# EAGLE design VDU_TMS_final_rev01 (EAGLE 9.6.2)
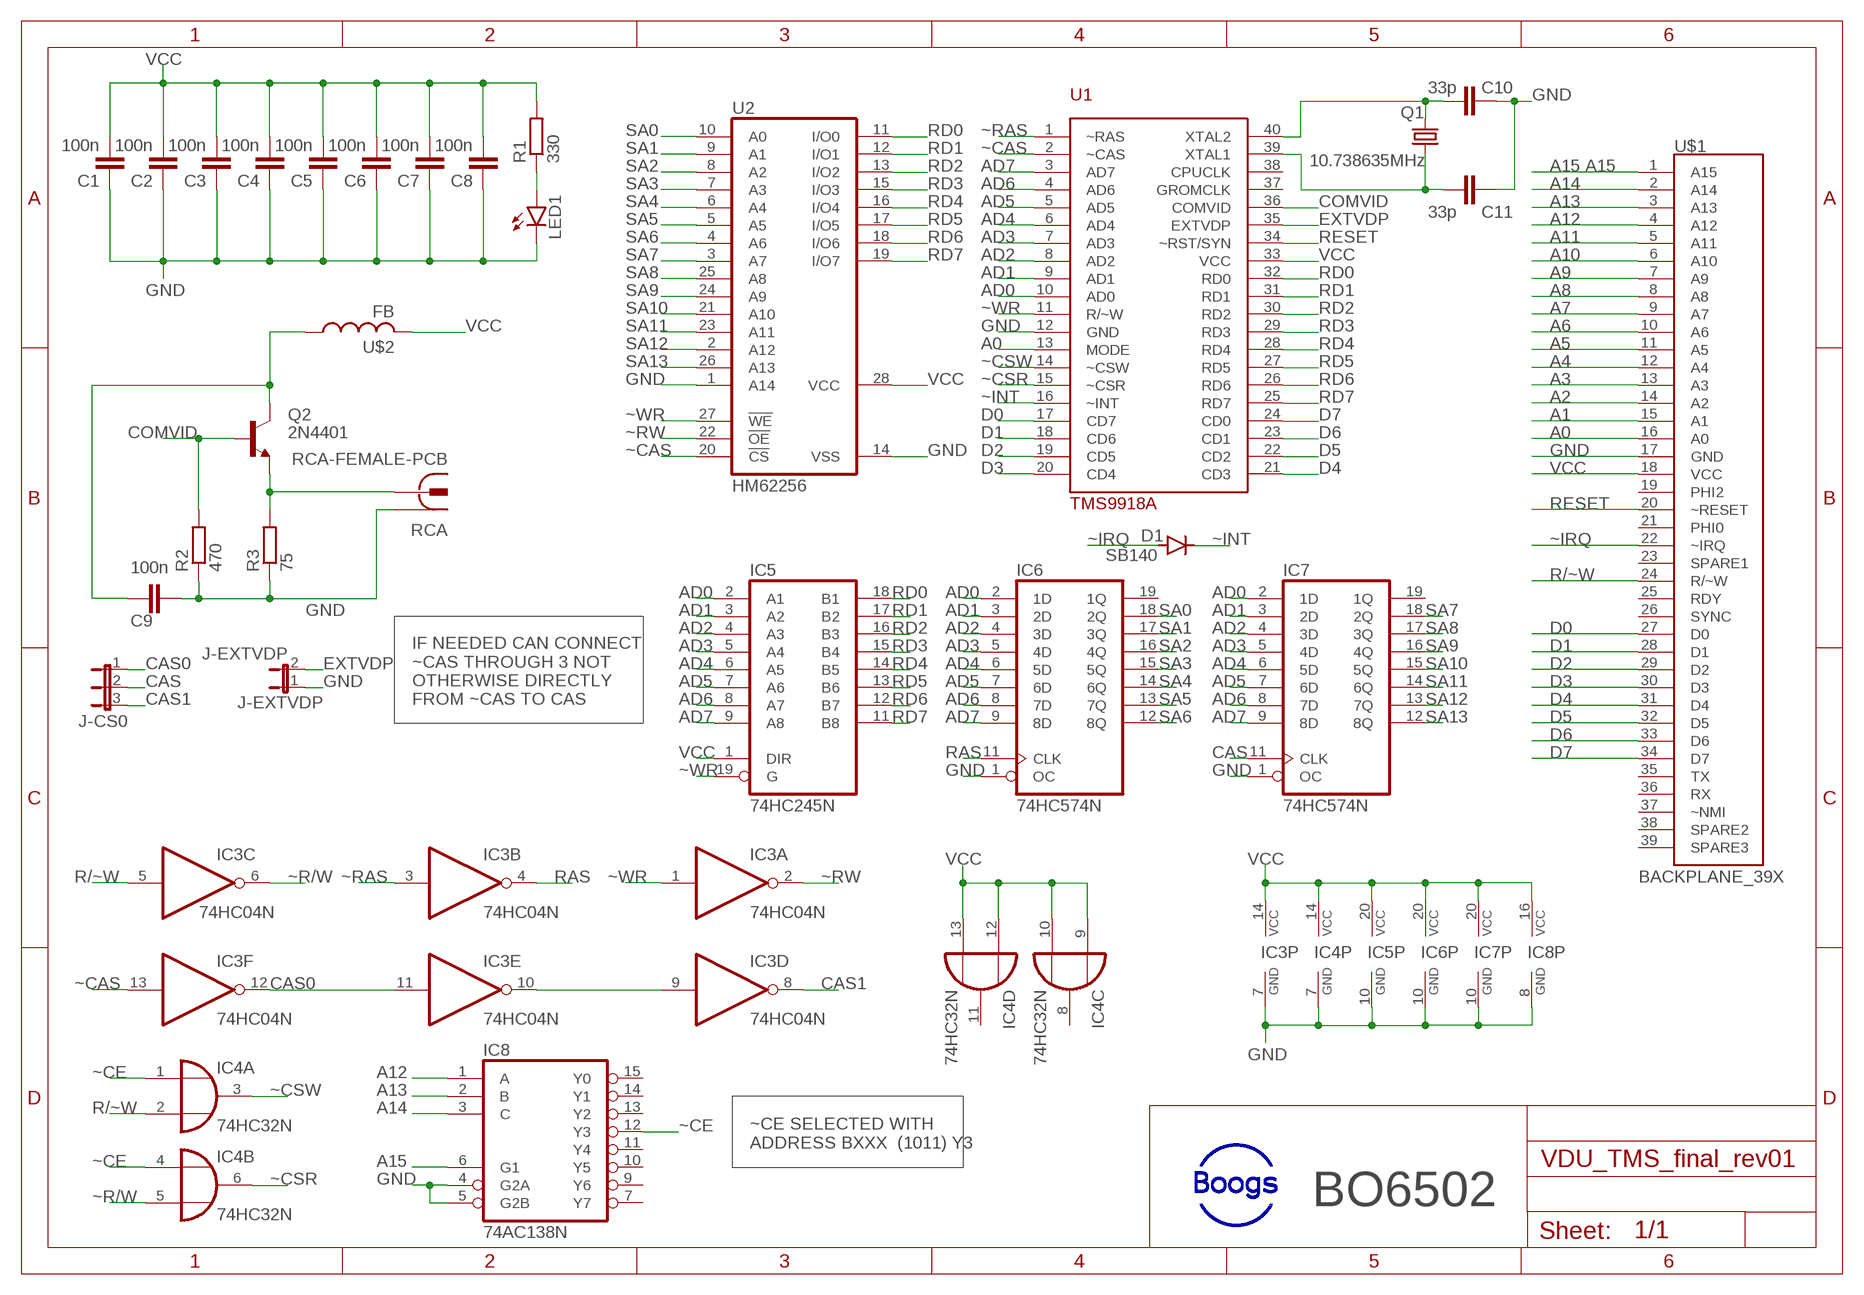
[diagram p0: schematic, sheet 1]

## Parts
C1  100n  C-EU025-025X050  [C025-025X050]
C2  100n  C-EU025-025X050  [C025-025X050]
C3  100n  C-EU025-025X050  [C025-025X050]
C4  100n  C-EU025-025X050  [C025-025X050]
C5  100n  C-EU025-025X050  [C025-025X050]
C6  100n  C-EU025-025X050  [C025-025X050]
C7  100n  C-EU025-025X050  [C025-025X050]
C8  100n  C-EU025-025X050  [C025-025X050]
C9  100n  C-EU025-025X050  [C025-025X050]
C10  33p  C-EU025-025X050  [C025-025X050]
C11  33p  C-EU025-025X050  [C025-025X050]
D1  SB140  1N4004  [DO41-10]
IC3  74HC04N  [DIL14]
IC4  74HC32N  [DIL14]
IC5  74HC245N  [DIL20]
IC6  74HC574N  [DIL20]
IC7  74HC574N  [DIL20]
IC8  74AC138N  [DIL16]
J-CAS  J-CS0  JP2E  [JP2]
J-EXTVDP  J-EXTVDP  JP1E  [JP1]
LED1  RED  LED5MM  [LED5MM]
Q1  10.738635MHz  CRYSTALHC49S  [HC49/S]
Q2  2N4401  -NPN-TO92-EBC  [TO92-EBC]
R1  330  R-EU_0207/10  [0207/10]
R2  470  R-EU_0207/10  [0207/10]
R3  75  R-EU_0207/10  [0207/10]
RCA  RCA-FEMALE-PCB  [RCA-FEMALE-PCB]
U1  TMS9918A  [DIL40]
U2  HM62256  62256P  [DIL28-6]
U$1  BACKPLANE_39X  [BP_39X]
U$2  FB  [FB]

## Nets
A0: U1.13(MODE) U$1.16(A0)
A1: U$1.15(A1)
A2: U$1.14(A2)
A3: U$1.13(A3)
A4: U$1.12(A4)
A5: U$1.11(A5)
A6: U$1.10(A6)
A7: U$1.9(A7)
A8: U$1.8(A8)
A9: U$1.7(A9)
A10: U$1.6(A10)
A11: U$1.5(A11)
A12: IC8.1(A) U$1.4(A12)
A13: IC8.2(B) U$1.3(A13)
A14: IC8.3(C) U$1.2(A14)
A15: IC8.6(G1) U$1.1(A15)
AD0: IC5.2(A1) IC6.2(1D) IC7.2(1D) U1.10(AD0)
AD1: IC5.3(A2) IC6.3(2D) IC7.3(2D) U1.9(AD1)
AD2: IC5.4(A3) IC6.4(3D) IC7.4(3D) U1.8(AD2)
AD3: IC5.5(A4) IC6.5(4D) IC7.5(4D) U1.7(AD3)
AD4: IC5.6(A5) IC6.6(5D) IC7.6(5D) U1.6(AD4)
AD5: IC5.7(A6) IC6.7(6D) IC7.7(6D) U1.5(AD5)
AD6: IC5.8(A7) IC6.8(7D) IC7.8(7D) U1.4(AD6)
AD7: IC5.9(A8) IC6.9(8D) IC7.9(8D) U1.3(AD7)
CAS: IC7.11(CLK) J-CAS.2
CAS0: IC3.11(E:I) IC3.12(F:O) J-CAS.1
CAS1: IC3.8(D:O) J-CAS.3
COMVID: Q2.B R2.2 U1.36(COMVID)
D0: U1.17(CD7) U$1.27(D0)
D1: U1.18(CD6) U$1.28(D1)
D2: U1.19(CD5) U$1.29(D2)
D3: U1.20(CD4) U$1.30(D3)
D4: U1.21(CD3) U$1.31(D4)
D5: U1.22(CD2) U$1.32(D5)
D6: U1.23(CD1) U$1.33(D6)
D7: U1.24(CD0) U$1.34(D7)
EXTVDP: J-EXTVDP.2 U1.35(EXTVDP)
GND: C1.1 C2.1 C3.1 C4.1 C5.1 C6.1 C7.1 C8.1 C9.1 C10.1 C11.1 IC3.7(P:GND) IC4.7(P:GND) IC5.10(GND) IC6.1(OC) IC6.10(GND) IC7.1(OC) IC7.10(GND) IC8.4(G2A) IC8.5(G2B) IC8.8(GND) J-EXTVDP.1 LED1.K(C) R2.1 R3.1 RCA.1 U1.12(GND) U2.1(A14) U2.14(VSS) U$1.17(GND)
N$2: Q2.E R3.2 RCA.2@1 RCA.2@2
N$3: C9.2 Q2.C U$2.P$1
N$5: C10.2 Q1.2 U1.40(XTAL2)
N$6: LED1.A R1.1
N$8: C11.2 Q1.1 U1.39(XTAL1)
N$12: IC3.9(D:I) IC3.10(E:O)
R/~W: IC3.5(C:I) IC4.2(A:I1) U$1.24(R/~W)
RAS: IC3.4(B:O) IC6.11(CLK)
RD0: IC5.18(B1) U1.32(RD0) U2.11(I/O0)
RD1: IC5.17(B2) U1.31(RD1) U2.12(I/O1)
RD2: IC5.16(B3) U1.30(RD2) U2.13(I/O2)
RD3: IC5.15(B4) U1.29(RD3) U2.15(I/O3)
RD4: IC5.14(B5) U1.28(RD4) U2.16(I/O4)
RD5: IC5.13(B6) U1.27(RD5) U2.17(I/O5)
RD6: IC5.12(B7) U1.26(RD6) U2.18(I/O6)
RD7: IC5.11(B8) U1.25(RD7) U2.19(I/O7)
RESET: U1.34(~RST/SYN) U$1.20(~RESET)
SA0: IC6.18(2Q) U2.10(A0)
SA1: IC6.17(3Q) U2.9(A1)
SA2: IC6.16(4Q) U2.8(A2)
SA3: IC6.15(5Q) U2.7(A3)
SA4: IC6.14(6Q) U2.6(A4)
SA5: IC6.13(7Q) U2.5(A5)
SA6: IC6.12(8Q) U2.4(A6)
SA7: IC7.18(2Q) U2.3(A7)
SA8: IC7.17(3Q) U2.25(A8)
SA9: IC7.16(4Q) U2.24(A9)
SA10: IC7.15(5Q) U2.21(A10)
SA11: IC7.14(6Q) U2.23(A11)
SA12: IC7.13(7Q) U2.2(A12)
SA13: IC7.12(8Q) U2.26(A13)
VCC: C1.2 C2.2 C3.2 C4.2 C5.2 C6.2 C7.2 C8.2 IC3.14(P:VCC) IC4.9(C:I0) IC4.10(C:I1) IC4.12(D:I0) IC4.13(D:I1) IC4.14(P:VCC) IC5.1(DIR) IC5.20(VCC) IC6.20(VCC) IC7.20(VCC) IC8.16(VCC) R1.2 U1.33(VCC) U2.28(VCC) U$1.18(VCC) U$2.P$2
~CAS: IC3.13(F:I) U1.2(~CAS) U2.20(!CS)
~CE: IC4.1(A:I0) IC4.4(B:I0) IC8.12(Y3)
~CSR: IC4.6(B:O) U1.15(~CSR)
~CSW: IC4.3(A:O) U1.14(~CSW)
~INT: D1.C U1.16(~INT)
~IRQ: D1.A U$1.22(~IRQ)
~R/W: IC3.6(C:O) IC4.5(B:I1)
~RAS: IC3.3(B:I) U1.1(~RAS)
~RW: IC3.2(A:O) U2.22(!OE)
~WR: IC3.1(A:I) IC5.19(G) U1.11(R/~W) U2.27(!WE)
Unconnected: IC4.8(C:O) IC4.11(D:O) IC6.19(1Q) IC7.19(1Q) IC8.7(Y7) IC8.9(Y6) IC8.10(Y5) IC8.11(Y4) IC8.13(Y2) IC8.14(Y1) IC8.15(Y0) U1.37(GROMCLK) U1.38(CPUCLK) U$1.19(PHI2) U$1.21(PHI0) U$1.23(SPARE1) U$1.25(RDY) U$1.26(SYNC) U$1.35(TX) U$1.36(RX) U$1.37(~NMI) U$1.38(SPARE2) U$1.39(SPARE3)

## Notes on the sheet
- IF NEEDED CAN CONNECT 
  ~CAS THROUGH 3 NOT 
  OTHERWISE DIRECTLY 
  FROM ~CAS TO CAS
- ~CE SELECTED WITH
  ADDRESS BXXX  (1011) Y3
- BO6502

## Library data of the parts
C1-C11 = rcl:C-EU: CAPACITOR, European symbol; SPICEPREFIX: C
D1 = diode:1N4004: DIODE general purpose rectifier, 1 A
IC3 = 74xx-eu:74*04: Hex INVERTER
IC4 = 74xx-eu:74*32: Quad 2-input OR gate
IC5 = 74xx-eu:74*245: Octal BUS TRANSCEIVER, 3-state
IC6 IC7 = 74xx-eu:74*574: 8-bit D type FLIP FLOP bus driver
IC8 = 74xx-eu:74*138: 3-line to 8-line DECODER/DEMULTIPLEXER
J-CAS = jumper:JP2E: JUMPER
J-EXTVDP = jumper:JP1E: JUMPER
LED1 = led:LED: LED OSRAM: - CHIPLED LG R971, LG N971, LY N971, LG Q971, LY Q971, LO R971, LY R971 LH N974, LH R974 LS Q976, LO Q976, LY Q976 LO Q996 - Hyper CHIPLED LW Q18S LB Q993, LB Q99A, LB R99A - SideLED LS A670, LO A670, LY A670, LG A670, LP A670 LB A673, LV A673, LT A673, LW A673 LH A674 LY A675 LS A676, LA A676, LO A676, LY A676, LW A676 LS A679, LY A679, LG A679 - Hyper Micro SIDELED® LS Y876, LA Y876, LO Y876, LY Y876 LT Y87S - SmartLED LW L88C, LW L88S LB L89C, LB L89S, LG L890 LS L89K, LO L89K, LY L89K LS L896, LA L896, LO L896, LY L896 - TOPLED LS T670, LO T670, LY T670, LG T670, LP T670 LSG T670, LSP T670, LSY T670, LOP T670, LYG T670 LG T671, LOG T671, LSG T671 LB T673, LV T673, LT T673, LW T673 LH T674 LS T676, LA T676, LO T676, LY T676, LB T676, LH T676, LSB T676, LW T676 LB T67C, LV T67C, LT T67C, LS T67K, LO T67K, LY T67K, LW E67C LS E67B, LA E67B, LO E67B, LY E67B, LB E67C, LV E67C, LT E67C LW T67C LS T679, LY T679, LG T679 LS T770, LO T770, LY T770, LG T770, LP T770 LB T773, LV T773, LT T773, LW T773 LH T774 LS E675, LA E675, LY E675, LS T675 LS T776, LA T776, LO T776, LY T776, LB T776 LHGB T686 LT T68C, LB T68C - Hyper Mini TOPLED® LB M676 - Mini TOPLED Santana® LG M470 LS M47K, LO M47K, LY M47K Source: http://www.osram.convergy.de LUXEON: - LUMILED® LXK2-PW12-R00, LXK2-PW12-S00, LXK2-PW14-U00, LXK2-PW14-V00 LXK2-PM12-R00, LXK2-PM12-S00, LXK2-PM14-U00 LXK2-PE12-Q00, LXK2-PE12-R00, LXK2-PE12-S00, LXK2-PE14-T00, LXK2-PE14-U00 LXK2-PB12-K00, LXK2-PB12-L00, LXK2-PB12-M00, LXK2-PB14-N00, LXK2-PB14-P00, LXK2-PB14-Q00 LXK2-PR12-L00, LXK2-PR12-M00, LXK2-PR14-Q00, LXK2-PR14-R00 LXK2-PD12-Q00, LXK2-PD12-R00, LXK2-PD12-S00 LXK2-PH12-R00, LXK2-PH12-S00 LXK2-PL12-P00, LXK2-PL12-Q00, LXK2-PL12-R00 Source: www.luxeon.com KINGBRIGHT: KA-3528ASYC Source: www.kingbright.com
Q1 = crystal:CRYSTAL: CRYSTAL; OC_FARNELL: 1667008; OC_NEWARK: unknown
Q2 = transistor:*-NPN-: NPN Transistror BF959 corrected 2008.03.06
R1-R3 = rcl:R-EU_: RESISTOR, European symbol; SPICEPREFIX: R
RCA = 65xx_family:RCA-FEMALE-PCB
U1 = 65xx_family:TMS9918A
U2 = memory-hitachi:62256P: MEMORY; OC_FARNELL: unknown; OC_NEWARK: unknown
U$1 = 65xx_family:BACKPLANE_39X; A15: A15
U$2 = adafruit:FB: Ferrite bead Digikey #P9821BK-ND

## Board
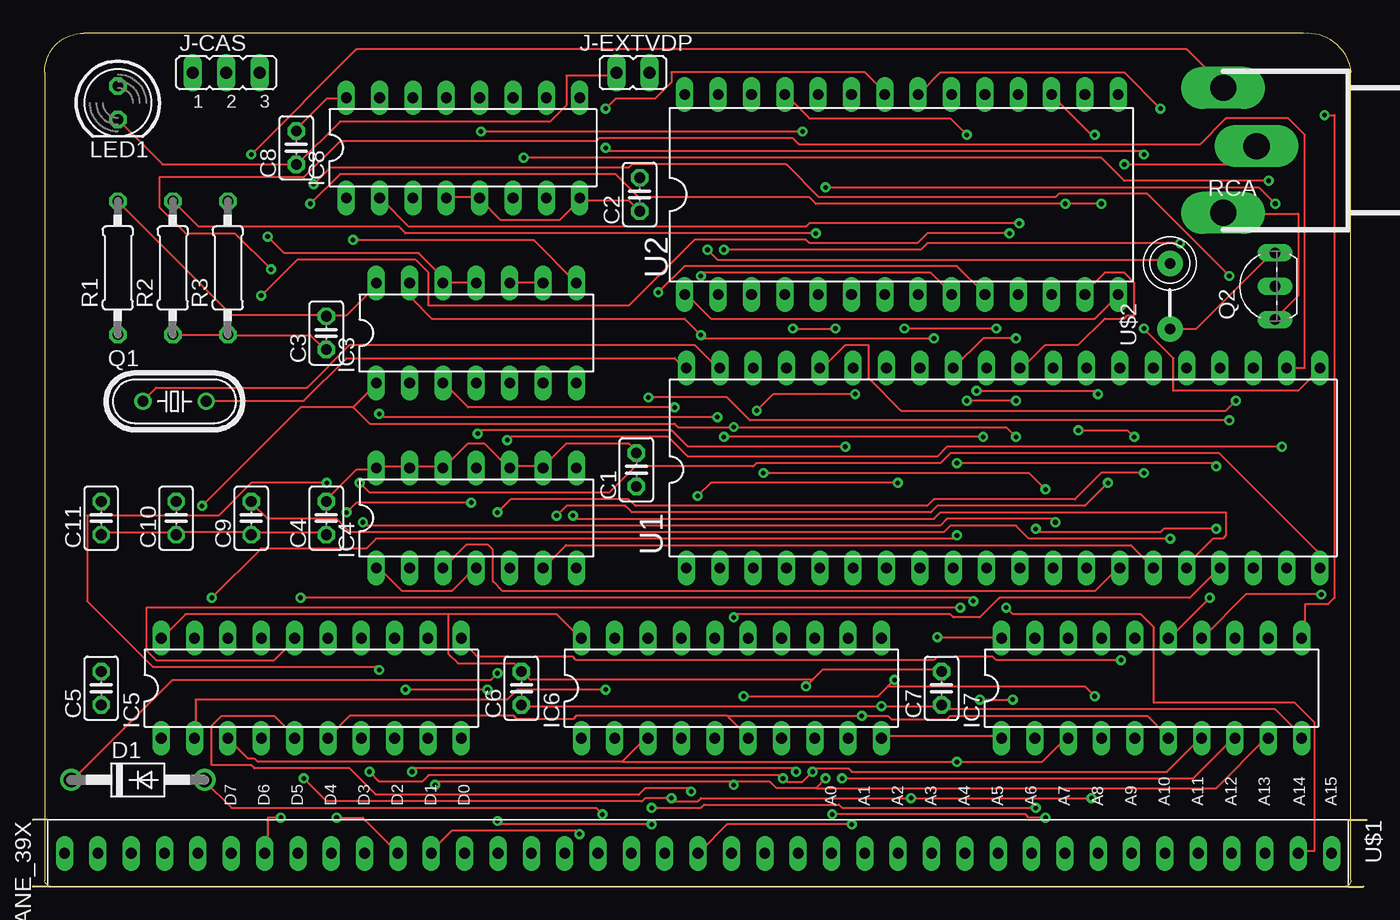
[diagram p1: board, top side]
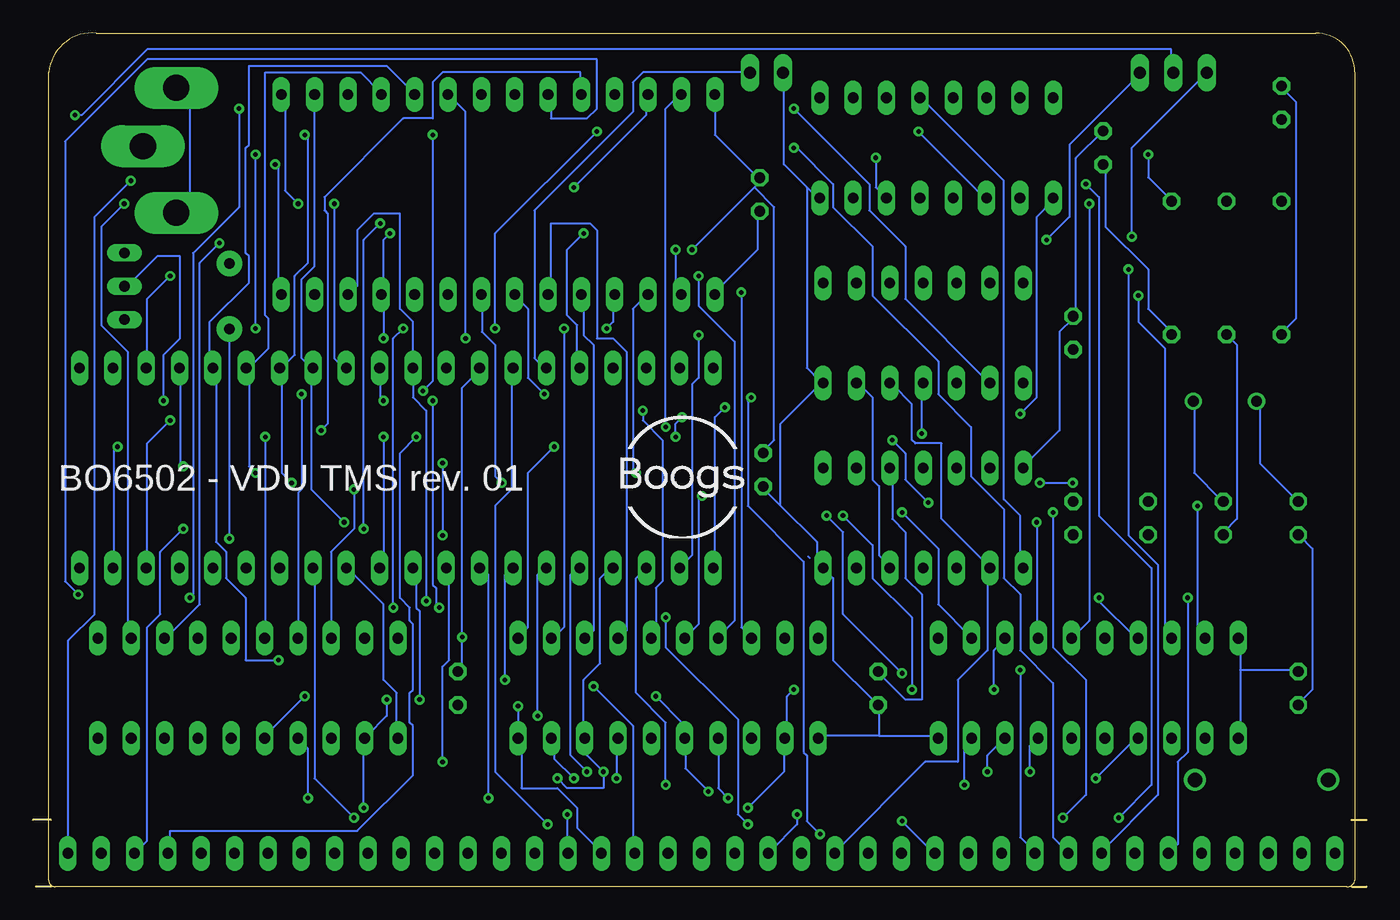
[diagram p2: board, bottom side, seen from below]

Size 101.6 x 65.02 mm. Coordinates in mm from the lower left corner, seen from the top.
Outline: 1.14,5.08 0,5.08
Outline: 1.14,0 0,0
Outline: 100.2,5.08 101.6,5.08
Outline: 100.2,0 101.35,0
Outline: 1.52,0 99.89,0 arc90 100.39,0.5 100.39,62 arc90 96.75,65 3.89,65 arc90 0.89,62 0.89,0.5 arc90 1.52,0
Copper layers (1*16): Top 0.035mm / dielectric 1.5mm / Bottom 0.035mm
Design rules "default *": minimum track width 6mil, minimum drill 0.35mm, track to track 10mil, track to pad 10mil, pad to pad 10mil, via to via 10mil, smd to smd 6mil, copper to edge 40mil, drill to drill 6mil, minimum pad ring 10mil, minimum via ring 8mil, stop-mask expansion 4mil, vias tented up to drill 15mil, thermal gap 10mil

### Footprints (pad centres in the part's own frame; a part is rotated, then mirrored left to right if it is on the bottom)
C025-025X050 = drill 0.813 octagon: 1 -1.27,0; 2 1.27,0
DO41-10 = drill 1.118: A 5.08,0; C -5.08,0
DIL14 = drill 0.813 long: 1 -7.62,-3.81; 2 -5.08,-3.81; 3 -2.54,-3.81; 4 0,-3.81; 5 2.54,-3.81; 6 5.08,-3.81; 7 7.62,-3.81; 8 7.62,3.81; 9 5.08,3.81; 10 2.54,3.81; 11 0,3.81; 12 -2.54,3.81; 13 -5.08,3.81; 14 -7.62,3.81
DIL20 = drill 0.813 long: 1 -11.43,-3.81; 2 -8.89,-3.81; 3 -6.35,-3.81; 4 -3.81,-3.81; 5 -1.27,-3.81; 6 1.27,-3.81; 7 3.81,-3.81; 8 6.35,-3.81; 9 8.89,-3.81; 10 11.43,-3.81; 11 11.43,3.81; 12 8.89,3.81; 13 6.35,3.81; 14 3.81,3.81; 15 1.27,3.81; 16 -1.27,3.81; 17 -3.81,3.81; 18 -6.35,3.81; 19 -8.89,3.81; 20 -11.43,3.81
DIL16 = drill 0.813 long: 1 -8.89,-3.81; 2 -6.35,-3.81; 3 -3.81,-3.81; 4 -1.27,-3.81; 5 1.27,-3.81; 6 3.81,-3.81; 7 6.35,-3.81; 8 8.89,-3.81; 9 8.89,3.81; 10 6.35,3.81; 11 3.81,3.81; 12 1.27,3.81; 13 -1.27,3.81; 14 -3.81,3.81; 15 -6.35,3.81; 16 -8.89,3.81
JP2 = drill 0.914 long: 1 -2.54,0; 2 0,0; 3 2.54,0
JP1 = drill 0.914 long: 1 0,-1.27; 2 0,1.27
LED5MM = drill 0.813 octagon: A -1.27,0; K 1.27,0
HC49/S = drill 0.813: 1 -2.413,0; 2 2.413,0
TO92-EBC = drill 0.813 long: B 0,-1.27; C 2.54,-1.27; E -2.54,-1.27
0207/10 = drill 0.813 octagon: 1 -5.08,0; 2 5.08,0
RCA-FEMALE-PCB = drill 2 pad 3.2 long: 1 2.54,0; 2@1 5.08,5.08; 2@2 5.08,-4.445
DIL40 = drill 0.813 long: 1 -24.13,-7.62; 2 -21.59,-7.62; 3 -19.05,-7.62; 4 -16.51,-7.62; 5 -13.97,-7.62; 6 -11.43,-7.62; 7 -8.89,-7.62; 8 -6.35,-7.62; 9 -3.81,-7.62; 10 -1.27,-7.62; 11 1.27,-7.62; 12 3.81,-7.62; 13 6.35,-7.62; 14 8.89,-7.62; 15 11.43,-7.62; 16 13.97,-7.62; 17 16.51,-7.62; 18 19.05,-7.62; 19 21.59,-7.62; 20 24.13,-7.62; 21 24.13,7.62; 22 21.59,7.62; 23 19.05,7.62; 24 16.51,7.62; 25 13.97,7.62; 26 11.43,7.62; 27 8.89,7.62; 28 6.35,7.62; 29 3.81,7.62; 30 1.27,7.62; 31 -1.27,7.62; 32 -3.81,7.62; 33 -6.35,7.62; 34 -8.89,7.62; 35 -11.43,7.62; 36 -13.97,7.62; 37 -16.51,7.62; 38 -19.05,7.62; 39 -21.59,7.62; 40 -24.13,7.62
DIL28-6 = drill 0.813 long: 1 -16.51,-7.62; 2 -13.97,-7.62; 3 -11.43,-7.62; 4 -8.89,-7.62; 5 -6.35,-7.62; 6 -3.81,-7.62; 7 -1.27,-7.62; 8 1.27,-7.62; 9 3.81,-7.62; 10 6.35,-7.62; 11 8.89,-7.62; 12 11.43,-7.62; 13 13.97,-7.62; 14 16.51,-7.62; 15 16.51,7.62; 16 13.97,7.62; 17 11.43,7.62; 18 8.89,7.62; 19 6.35,7.62; 20 3.81,7.62; 21 1.27,7.62; 22 -1.27,7.62; 23 -3.81,7.62; 24 -6.35,7.62; 25 -8.89,7.62; 26 -11.43,7.62; 27 -13.97,7.62; 28 -16.51,7.62
BP_39X = drill 0.813 long: 1 1.27,59.69; 2 1.27,57.15; 3 1.27,54.61; 4 1.27,52.07; 5 1.27,49.53; 6 1.27,46.99; 7 1.27,44.45; 8 1.27,41.91; 9 1.27,39.37; 10 1.27,36.83; 11 1.27,34.29; 12 1.27,31.75; 13 1.27,29.21; 14 1.27,26.67; 15 1.27,24.13; 16 1.27,21.59; 17 1.27,19.05; 18 1.27,16.51; 19 1.27,13.97; 20 1.27,11.43; 21 1.27,8.89; 22 1.27,6.35; 23 1.27,3.81; 24 1.27,1.27; 25 1.27,-1.27; 26 1.27,-3.81; 27 1.27,-6.35; 28 1.27,-8.89; 29 1.27,-11.43; 30 1.27,-13.97; 31 1.27,-16.51; 32 1.27,-19.05; 33 1.27,-21.59; 34 1.27,-24.13; 35 1.27,-26.67; 36 1.27,-29.21; 37 1.27,-31.75; 38 1.27,-34.29; 39 1.27,-36.83
FB = drill 0.8 pad 1.93: P$1 -2.5,0; P$2 2.5,0

### Placement (x,y rotation side)
C1  45.97,31.75 90 top
C2  46.23,52.71 90 top
C3  22.35,42.17 90 top
C4  22.35,28.07 90 top
C5  5.21,15.12 90 top
C6  37.21,15.12 90 top
C7  69.21,15.12 90 top
C8  20.07,56.26 90 top
C9  16.64,28.07 90 top
C10  10.92,28.07 90 top
C11  5.21,28.07 90 top
D1  8,8.13 0 top
IC3  33.78,42.17 0 top
IC4  33.78,28.07 0 top
IC5  21.21,15.12 0 top
IC6  53.21,15.12 0 top
IC7  85.22,15.12 0 top
IC8  32.77,56.26 0 top
J-CAS  14.73,61.98 0 top
J-EXTVDP  45.72,61.98 270 top
LED1  6.48,59.69 270 top
Q1  10.79,36.96 0 top
Q2  93.34,45.72 90 top
R1  6.48,47.12 90 top
R2  10.67,47.12 90 top
R3  14.86,47.12 90 top
RCA  95.76,56.39 180 top
U1  73.91,31.88 0 top
U2  66.17,52.71 0 top
U$1  39.24,3.81 270 top
U$2  86.61,44.96 90 top

### Tracks (layer width: path | path; a pad name or v marks a point on that pad's centre or on a via)
A0  (via drill 0.35)
  Top 0.152: v60.89,5.5 75.64,5.5 75.89,5.25 v77.14,5.25
  Bottom 0.152: v60.89,5.5 60.89,2.75 U$1.16 | v77.14,5.25 80.14,8.25 80.14,24.25 U1.13
A12  (via drill 0.35)
  Top 0.152: v26.39,36 26.64,35.75 v52.14,35.75 | v72.39,34.25 v52.64,34.25
  Bottom 0.152: v26.39,36 25.14,37.25 25.14,51 23.89,52.25 IC8.1 | v52.14,35.75 52.64,35.25 v52.64,34.25 | v72.39,34.25 73.64,33 73.64,22 72.89,21.25 72.89,20.25 72.64,20 72.64,15 72.89,14.75 72.89,12.5 72.64,12.25 72.64,8.5 76.89,4.25 91.14,4.25 91.14,2.75 U$1.4
A13  (via drill 0.35)
  Top 0.152: v75.14,50.5 59.14,50.5 58.89,50.25 28.64,50.25 26.64,52.25 IC8.2 | v76.39,27.25 76.64,27 85.89,27 86.14,27.25 v90.14,27.25
  Bottom 0.152: v75.14,50.5 76.39,49.25 v76.39,27.25 | v90.14,27.25 91.89,25.5 91.89,20.75 92.89,19.75 92.89,3.5 93.64,2.75 U$1.3
A14  (via drill 0.35)
  Top 0.152: v58.64,57.5 v34.14,57.5 | v73.39,42.5 v66.39,42.5 | v74.14,21.25 74.64,20.75 84.39,20.75 85.39,19.75 85.39,14 96.14,14 97.64,12.5 97.64,2.75 96.64,2.75 U$1.2
  Bottom 0.152: v34.14,57.5 29.14,52.5 IC8.3 | v58.64,57.5 66.39,49.75 v66.39,42.5 | v73.39,42.5 74.14,41.75 v74.14,21.25
A15  (via drill 0.35)
  Top 0.152: v37.39,55.5 81.39,55.5 83.14,53.75 v94.14,53.75
  Bottom 0.152: v37.39,55.5 37.39,53.25 36.64,52.5 IC8.6 | v94.14,53.75 96.89,51 96.89,20.75 98.89,18.75 98.89,2.75 U$1.1
AD0  (via drill 0.35)
  Top 0.152: v72.14,14.25 v74.64,14.25 | v43.64,15 36.89,15 36.14,14.25 12.39,14.25 12.39,11.5 IC5.2 | v76.39,6 61.64,6 61.39,6.25 51.14,6.25 50.89,6 v47.14,6
  Bottom 0.152: v74.64,14.25 74.64,13 76.14,11.5 IC7.2 76.39,11.25 v76.39,6 | v72.14,14.25 72.14,21 72.39,21.25 72.39,24 U1.10 | v43.64,15 44.14,14.5 44.14,11.5 IC6.2 44.39,11.25 44.39,8.75 v47.14,6
AD1  (via drill 0.35)
  Top 0.152: 44.89,9.5 17.14,9.5 16.89,9.75 16.39,9.75 14.89,11.25 IC5.3 | 44.89,9.5 46.64,11.25 IC6.3 | 44.89,9.5 v70.39,9.5 76.89,9.5 78.64,11.25 IC7.3
  Bottom 0.152: v70.39,9.5 70.39,16.75 69.89,17.25 69.89,24.25 U1.9
AD2  (via drill 0.35)
  Top 0.152: v20.64,8.25 22.39,6.5 46.39,6.5 46.64,6.75 v48.64,6.75 48.89,6.5 50.64,6.5 50.89,6.75 v66.89,6.75 v80.64,6.75
  Bottom 0.152: v20.64,8.25 17.64,11.25 IC5.4 | v48.64,6.75 49.39,7.5 49.39,11.25 IC6.4 | v66.89,6.75 66.89,23.75 67.39,24.25 U1.8 | v80.64,6.75 80.64,10.5 81.39,11.25 IC7.4
AD3  (via drill 0.35)
  Top 0.152: v50.14,7.25 49.89,7.5 46.64,7.5 46.14,7 26.14,7 24.14,9 16.89,9 16.64,9.25 13.64,9.25 13.64,12.25 14.39,13 18.39,13 19.89,11.5 IC5.5 | 65.14,15.25 64.39,14.5 v54.14,14.5 | 65.14,15.25 v65.64,15.75 | v80.89,14.5 80.14,15.25 65.14,15.25
  Bottom 0.152: v50.14,7.25 51.89,9 51.89,11.25 IC6.5 52.14,11.5 52.14,12.5 v54.14,14.5 | v65.64,15.75 65.64,23.75 65.14,24.25 U1.7 | v80.89,14.5 83.89,11.5 IC7.5
AD4  (via drill 0.35)
  Top 0.152: 52.89,13 41.39,13 41.14,12.75 36.89,12.75 36.64,13 24.14,13 22.64,11.5 IC5.6 | 52.89,13 54.39,11.5 IC6.6 | 52.89,13 v63.14,13 65.14,13 65.39,12.75 69.64,12.75 69.89,13 84.89,13 86.39,11.5 IC7.6
  Bottom 0.152: v63.14,13 63.14,23.75 62.64,24.25 U1.6
AD5  (via drill 0.35)
  Top 0.152: v25.64,8.75 26.39,8 29.64,8 30.14,8.5 56.89,8.5 v57.14,8.25 57.39,8 58.64,8 v59.39,8.75 59.64,9 62.14,9 62.39,8.75 86.39,8.75 88.89,11.25 IC7.7
  Bottom 0.152: v25.64,8.75 25.64,10.75 25.14,11.25 IC5.7 | v57.14,8.25 57.14,11.25 IC6.7 | v59.39,8.75 60.64,10 60.64,23.75 60.14,24.25 U1.5
AD6  (via drill 0.35)
  Top 0.152: v28.89,8.75 29.14,9 57.89,9 v58.14,8.75 | v61.64,8.25 88.39,8.25 91.39,11.25 IC7.8
  Bottom 0.152: v28.89,8.75 28.89,10 27.64,11.25 IC5.8 | U1.4 57.64,24.25 58.39,23.5 58.39,17 59.64,15.75 59.64,11.5 IC6.8 59.39,11.25 59.39,10 v58.14,8.75 58.14,7.5 60.89,7.5 v61.64,8.25
AD7  (via drill 0.35)
  Top 0.152: v30.64,7.75 30.89,8 53.39,8 | 53.39,8 56.14,8 56.64,7.5 59.64,7.5 | v60.39,8.25 59.64,7.5 | 53.39,8 v53.39,7.75 | 59.64,7.5 90.14,7.5 93.89,11.25 IC7.9
  Bottom 0.152: v30.64,7.75 30.64,10.75 30.14,11.25 IC5.9 | v60.39,8.25 61.89,9.75 61.89,11.25 IC6.9 | v53.39,7.75 53.39,12.5 55.64,14.75 55.64,23.5 54.89,24.25 U1.3
CAS  (via drill 0.35)
  Top 0.152: v98.39,58.75 99.14,58.75 99.14,22 98.64,21.5 96.89,21.5 96.89,19 IC7.11
  Bottom 0.152: v98.39,58.75 97.89,58.75 92.89,63.75 14.89,63.75 14.89,62 J-CAS.2
CAS0  (via drill 0.35)
  Top 0.152: 31.64,46 33.64,46 IC3.11 | 31.64,46 31.39,46 IC3.12 31.64,46 | v17.89,49.5 19.14,48.25 29.39,48.25 31.64,46
  Bottom 0.152: v17.89,49.5 17.89,56.25 12.39,61.75 J-CAS.1
CAS1  (via drill 0.35)
  Top 0.152: v24.39,49.25 38.14,49.25 41.39,46 IC3.8
  Bottom 0.152: v24.39,49.25 22.64,51 22.64,56.5 17.39,61.75 J-CAS.3
COMVID  (via drill 0.35)
  Top 0.152: v59.64,49.75 28.39,49.75 27.89,50.25 12.64,50.25 10.89,52 R2.2 | v91.64,37 90.89,36.25 66.14,36.25 63.64,38.75 63.64,41.25 61.89,41.25 60.14,39.5 U1.36
  Bottom 0.152: v59.64,49.75 60.89,48.5 60.89,43.5 60.14,42.75 60.14,39.5 U1.36 | v91.64,37 91.64,40.5 90.39,41.75 90.39,48 92.14,48 94.39,45.75 Q2.B
D0  (via drill 0.35)
  Top 0.152: v35.39,5 35.64,4.75 v47.14,4.75 | v53.39,20.5 53.64,20.75 69.89,20.75 70.14,20.5 72.14,20.5 73.64,22 88.14,22 90.39,24.25 U1.17
  Bottom 0.152: v35.39,5 33.14,2.75 U$1.27 | v47.14,4.75 47.89,5.5 47.89,12.75 53.39,18.25 v53.39,20.5
D1  (via drill 0.35)
  Top 0.152: v41.64,4 41.39,4.25 31.89,4.25 30.39,2.75 U$1.28 | v46.89,37.25 52.89,37.25 54.64,35.5 v91.14,35.5
  Bottom 0.152: v41.64,4 42.64,5 42.64,10 42.89,10.25 42.89,24.75 47.14,29 47.14,37 v46.89,37.25 | v91.14,35.5 92.89,33.75 92.89,24.5 U1.18
D2  (via drill 0.35)
  Top 0.152: v23.14,5.25 25.14,5.25 27.64,2.75 U$1.29 | v23.89,28.5 24.64,29.25 v33.39,29.25 | v36.14,34 36.39,34.25 48.39,34.25 49.89,32.75 68.89,32.75 69.64,33.5 v95.14,33.5
  Bottom 0.152: v23.14,5.25 21.39,7 21.39,15.75 23.89,18.25 v23.89,28.5 | v33.39,29.25 35.14,31 35.14,33 v36.14,34 | v95.14,33.5 95.39,33.25 95.39,24.5 U1.19
D3  (via drill 0.35)
  Top 0.152: v26.39,16.5 26.14,16.75 9.14,16.75 4.14,21.75 4.14,28.25 14.14,28.25 16.64,30.75 v22.39,30.75 | v24.89,30.75 25.64,30 43.89,30 45.89,32 54.89,32 55.14,32.25 69.14,32.25 69.89,33 90.39,33 97.89,25.5 97.89,24.5 U1.20
  Bottom 0.152: v26.39,16.5 26.39,3.75 25.39,2.75 U$1.30 | v24.89,30.75 v22.39,30.75
D4  (via drill 0.35)
  Top 0.152: v43.64,56.25 43.89,56 84.39,56 v84.64,55.75 | v84.64,42.5 86.89,40.25 86.89,37.75 96.39,37.75 97.89,39.25 U1.21
  Bottom 0.152: v43.64,56.25 43.39,56.25 40.64,53.5 40.64,51.75 37.64,48.75 37.64,45 32.64,40 32.64,37.5 30.14,35 30.14,31.25 27.64,28.75 27.64,23.5 26.39,22.25 26.39,18 23.89,15.5 23.89,3.75 22.89,2.75 U$1.31 | v84.64,42.5 v84.64,55.75
D5  (via drill 0.35)
  Top 0.152: v18.14,47 15.39,49.75 11.64,49.75 9.64,51.75 9.64,54 20.64,54 23.39,56.75 42.89,56.75 43.14,57 57.89,57 58.39,56.5 88.89,56.5 90.89,58.5 95.64,58.5 96.89,57.25 96.89,39.5 95.64,39.5 U1.22
  Bottom 0.152: v18.14,47 18.14,26.75 15.89,24.5 15.89,7 20.14,2.75 U$1.32
D6  (via drill 0.35)
  Top 0.152: v18.89,5.25 17.89,5.25 17.89,2.75 U$1.33 | v21.39,53.5 22.64,54.75 45.39,54.75 45.64,55 57.39,55 59.89,52.5 77.89,52.5 78.14,52.75 84.89,52.75 v91.14,46.5
  Bottom 0.152: v18.89,5.25 16.39,7.75 16.39,24.25 20.39,28.25 20.39,52.5 v21.39,53.5 | v91.14,46.5 92.89,44.75 92.89,39.5 U1.23
D7  (via drill 0.35)
  Top 0.152: v13.64,22 17.39,25.75 25.39,25.75 26.14,26.5 70.14,26.5 v70.39,26.75 | v70.39,32.25 89.89,32.25 v90.14,32
  Bottom 0.152: v13.64,22 13.64,10.25 14.39,9.5 14.39,3.25 14.89,2.75 U$1.34 | v70.39,32.25 v70.39,26.75 | v90.14,32 90.39,32.25 90.39,39.25 U1.24
EXTVDP
  Bottom 0.152: U1.35 62.64,39.5 63.39,40.25 63.39,51.5 55.89,59 55.89,61.25 55.14,62 47.14,62 J-EXTVDP.2
GND  (via drill 0.35)
  Top 0.152: IC7.1 73.64,11.5 64.89,11.5 IC6.10 | IC7.10 96.64,11.5 94.64,13.5 69.64,13.5 69.39,13.75 C7.1 69.14,13.75 v64.64,13.75 37.39,13.75 C6.1 | C4.1 22.14,27 16.64,27 C9.1 16.39,27 11.14,27 C10.1 10.89,27 5.39,27 C11.1 | R2.1 10.89,42 14.64,42 R3.1 14.89,42 21.14,42 22.14,41 C3.1 | LED1.K 6.64,58.25 9.89,55 19.89,55 C8.1 20.14,55 23.39,58.25 39.39,58.25 40.64,59.5 40.64,61.75 44.39,61.75 J-EXTVDP.1 | IC8.4 31.64,52.5 33.89,52.5 IC8.5 34.14,52.25 35.64,50.75 40.14,50.75 41.64,52.25 IC8.8 41.89,52.25 45.39,52.25 46.14,51.5 C2.1 | U2.14 82.64,45 80.89,43.25 51.64,43.25 49.89,45 U2.1 | v83.14,55 91.89,55 93.14,56.25 RCA.1
  Bottom 0.152: U$1.17 58.39,2.75 60.14,4.5 60.14,6 61.64,7.5 64.39,7.5 64.39,11 64.64,11.25 IC6.10 64.64,11.5 v64.64,13.75 | U1.12 77.64,24.25 74.89,21.5 74.89,15.75 73.89,14.75 73.89,11.5 IC7.1 | 37.14,11.5 32.64,11.5 IC5.10 | 37.14,11.5 37.14,13.75 C6.1 37.39,14 40.64,17.25 40.64,23.5 IC4.7 41.64,24.5 41.89,24.75 41.89,26.25 44.64,29 | 37.14,11.5 41.64,11.5 IC6.1 | 44.64,29 45.89,30.25 C1.1 | 44.64,29 44.64,35.25 41.64,38.25 IC3.7 41.64,38.5 42.64,39.5 42.64,53.25 | C5.1 5.14,14 4.14,15 4.14,25.75 5.14,26.75 C11.1 | R3.1 14.89,42.25 16.64,44 16.64,47 19.89,50.25 19.89,54.75 C8.1 | C10.1 10.89,27 9.89,28 9.89,41.25 10.64,42 R2.1 | U2.1 49.64,45.25 46.39,48.5 46.39,51.25 C2.1 | 42.64,53.25 41.89,52.5 IC8.8 | 42.64,53.25 44.39,55 44.39,61.75 J-EXTVDP.1 | v83.14,55 82.89,54.75 82.89,45.25 U2.14
N$2  (via drill 0.35)
  Top 0.152: Q2.E 94.64,43.25 96.39,45 96.39,51.25 90.89,51.25 RCA.2@1 | v16.64,55.75 24.64,63.75 87.89,63.75 90.64,61 RCA.2@2
  Bottom 0.152: v16.64,55.75 16.64,54 14.89,52.25 R3.2 | RCA.2@1 90.64,51.5 89.64,52.5 89.64,59.75 90.64,60.75 RCA.2@2
N$3  (via drill 0.35)
  Top 0.152: v86.64,26.5 75.89,26.5 74.89,27.5 69.89,27.5 69.39,27 24.14,27 23.14,28 17.89,28 16.64,29.25 C9.2 | Q2.C 94.39,48.25 88.64,42.5 86.64,42.5 U$2.P$1
  Bottom 0.152: v86.64,26.5 86.64,42.25 U$2.P$1
N$5
  Top 0.152: U1.40 49.64,39.5 48.89,40.25 23.89,40.25 20.64,37 13.39,37 Q1.2
  Bottom 0.152: C10.2 11.14,29.5 13.14,31.5 13.14,36.75 Q1.2
N$6
  Bottom 0.152: R1.1 6.39,42.25 5.39,43.25 5.39,59.75 6.39,60.75 LED1.A
N$8
  Top 0.152: U1.39 52.14,39.5 50.39,41.25 24.14,41.25 20.89,38 9.39,38 8.39,37 Q1.1
  Bottom 0.152: C11.2 5.39,29.5 8.14,32.25 8.14,36.75 Q1.1
N$12
  Top 0.152: IC3.10 36.39,46 38.64,46 IC3.9
N$16
  Bottom 0.152: 42.55,25.15 42.42,25.02
R/~W
  Bottom 0.152: U$1.24 40.39,2.75 33.64,9.5 31.14,9.5 31.14,15.75 28.89,18 28.89,24.25 IC4.2 28.89,24.5 32.39,28 32.39,33.75 34.39,33.75 34.64,34 34.64,36.75 36.14,38.25 IC3.5
RAS  (via drill 0.35)
  Top 0.152: v33.89,34.5 34.14,34.75 48.64,34.75 49.89,33.5 v61.89,33.5
  Bottom 0.152: v33.89,34.5 33.89,38.25 IC3.4 | v61.89,33.5 63.89,31.5 63.89,19.75 64.64,19 IC6.11
RD0  (via drill 0.35)
  Top 0.152: v17.39,45 20.14,47.75 29.14,47.75 30.14,46.75 30.14,44.25 45.39,44.25 50.39,49.25 58.89,49.25 59.14,49 67.39,49 68.14,49.75 v74.39,49.75 | v74.89,41.75 72.39,41.75 70.14,39.5 U1.32
  Bottom 0.152: v17.39,45 17.39,43 15.39,41 15.39,19.5 14.89,19 IC5.18 | v74.39,49.75 74.89,49.25 74.89,45.25 U2.11 74.89,45 v74.89,41.75
RD1  (via drill 0.35)
  Top 0.152: v20.39,22 71.39,22 v71.64,21.75
  Bottom 0.152: v20.39,22 20.39,21.75 17.64,19 IC5.17 | v71.64,21.75 71.64,36.25 72.64,37.25 72.64,39.25 U1.31 72.64,43 73.64,44 73.64,51.25 75.64,51.25 76.89,50 76.89,45.75 77.39,45.25 U2.12
RD2  (via drill 0.35)
  Top 0.152: v70.64,21.25 8.64,21.25 8.64,18 9.39,17.25 18.39,17.25 19.89,18.75 IC5.16 | v74.89,37 v71.14,37 | U2.13 80.14,45.25 81.64,46.75 83.14,46.75 83.89,46 83.89,43.5 83.39,43.5 83.14,43.25 81.64,43.25 79.64,41.25 77.14,41.25 75.39,39.5 U1.30
  Bottom 0.152: v70.64,21.25 70.89,21.5 70.89,22.75 71.14,23 v71.14,37 | v74.89,37 75.14,37.25 75.14,39.25 U1.30
RD3  (via drill 0.35)
  Top 0.152: v21.14,52 23.39,54.25 44.39,54.25 46.14,52.5 59.14,52.5 59.64,52 v78.64,52 v81.39,52
  Bottom 0.152: v21.14,52 21.14,20.25 22.39,19 IC5.15 | v81.39,52 82.39,53 82.39,60 82.64,60.25 U2.15 | v78.64,52 78.64,40.25 77.89,39.5 U1.29
RD4  (via drill 0.35)
  Top 0.152: v25.14,27.75 25.39,27.5 69.14,27.5 69.64,28 77.64,28 v77.89,27.75
  Bottom 0.152: v25.14,27.75 25.14,19 IC5.14 | v77.89,27.75 80.39,30.25 80.39,39.25 U1.28 80.39,39.5 81.14,40.25 81.14,46.25 80.14,47.25 80.14,60.25 U2.16
RD5  (via drill 0.35)
  Top 0.152: v34.64,15 v28.39,15 | v39.89,28.25 40.64,29 45.14,29 45.64,28.5 68.39,28.5 68.89,29 80.14,29 v81.89,30.75 | v80.89,57.25 80.64,57.25 77.64,60.25 U2.17
  Bottom 0.152: v28.39,15 28.39,18 27.64,18.75 IC5.13 | v34.64,15 34.64,20.5 37.64,23.5 37.64,26 v39.89,28.25 | v81.89,30.75 82.64,31.5 82.64,39.25 U1.27 82.64,39.5 81.64,40.5 81.64,46.5 80.64,47.5 80.64,57 v80.89,57.25
RD6  (via drill 0.35)
  Top 0.152: v35.39,28.5 36.39,29.5 45.39,29.5 45.89,29 68.14,29 68.64,29.5 79.39,29.5 81.39,31.5 v84.64,31.5
  Bottom 0.152: v35.39,28.5 32.64,25.75 32.64,21.5 30.14,19 IC5.12 | v84.64,31.5 85.14,32 85.14,39.25 U1.26 85.14,39.5 83.64,41 83.64,43.25 83.89,43.5 83.89,62 76.64,62 75.14,60.5 U2.18
RD7  (via drill 0.35)
  Top 0.152: v82.89,17.25 73.39,17.25 73.14,17.5 68.89,17.5 68.64,17.25 41.39,17.25 41.14,17.5 33.89,17.5 32.64,18.75 IC5.11
  Bottom 0.152: v82.89,17.25 85.39,17.25 85.39,22 86.89,23.5 86.89,25.5 87.64,26.25 87.64,39.25 U1.25 88.14,39.75 88.14,43 85.14,46 85.14,48 85.39,48.25 85.39,56.25 85.14,56.5 85.14,62.5 74.64,62.5 72.64,60.5 U2.19
RESET  (via drill 0.35)
  Top 0.152: v62.39,4.75 52.89,4.75 50.89,2.75 U$1.20
  Bottom 0.152: v62.39,4.75 66.39,8.75 66.39,29 65.14,30.25 65.14,39.25 U1.34
SA0  (via drill 0.35)
  Top 0.152: v47.64,45.25 49.64,47.25 70.39,47.25 72.39,45.25 U2.10
  Bottom 0.152: v47.64,45.25 47.64,19.75 46.89,19 IC6.18
SA1  (via drill 0.35)
  Top 0.152: v50.89,46.5 51.14,46.75 68.39,46.75 69.89,45.25 U2.9
  Bottom 0.152: v50.89,46.5 50.89,44.25 48.14,41.5 48.14,20.25 49.39,19 IC6.17
SA2  (via drill 0.35)
  Top 0.152: v50.64,29.75 51.64,30.75 v65.89,30.75
  Bottom 0.152: v50.64,29.75 50.89,29.5 50.89,20 51.89,19 IC6.16 | v65.89,30.75 66.39,31.25 66.39,41.25 67.39,42.25 67.39,45 U2.8
SA3  (via drill 0.35)
  Top 0.152: v55.14,36.25 56.39,37.5 v62.64,37.5
  Bottom 0.152: v55.14,36.25 55.14,35.5 53.64,34 53.64,23.25 54.14,22.75 54.14,19.25 54.39,19 IC6.15 | v62.64,37.5 63.89,38.75 63.89,44 64.89,45 U2.7
SA4
  Bottom 0.152: IC6.14 56.89,19 56.39,19.5 56.39,40.75 57.39,41.75 58.64,41.75 58.64,50 59.14,50.5 62.14,50.5 62.14,45.25 U2.6
SA5
  Bottom 0.152: IC6.13 59.39,19 58.89,19.5 58.89,41.25 59.64,42 59.64,45 U2.5
SA6  (via drill 0.35)
  Top 0.152: v57.89,42.5 v61.14,42.5
  Bottom 0.152: v61.14,42.5 61.14,19.75 61.89,19 IC6.12 | v57.89,42.5 57.39,43 57.39,45 U2.4
SA7  (via drill 0.35)
  Top 0.152: v77.14,30.25 75.89,31.5 v55.64,31.5
  Bottom 0.152: v77.14,30.25 77.14,27.25 78.89,25.5 78.89,19 IC7.18 | v55.64,31.5 55.89,31.75 55.89,44 54.89,45 U2.3
SA8  (via drill 0.35)
  Top 0.152: v81.14,37.5 80.89,37.75 v71.89,37.75 | v71.14,57.25 69.89,58.5 59.14,58.5 57.39,60.25 U2.25
  Bottom 0.152: v81.14,37.5 81.14,30.25 81.39,30 81.39,19 IC7.17 | v71.89,37.75 71.14,38.5 v71.14,57.25
SA9  (via drill 0.35)
  Top 0.152: v83.89,34.25 83.39,34.75 v79.64,34.75
  Bottom 0.152: v83.89,34.25 83.89,19 IC7.16 | v79.64,34.75 79.14,35.25 79.14,51.25 79.39,51.5 79.39,52.5 73.39,58.5 71.14,58.5 71.14,61.25 70.39,62 59.89,62 59.89,60.5 U2.24
SA10  (via drill 0.35)
  Top 0.152: v89.64,22 86.64,19 IC7.15 | v85.89,59.25 83.14,62 69.14,62 67.64,60.5 U2.21
  Bottom 0.152: v89.64,22 89.39,22.25 89.39,48.25 85.89,51.75 v85.89,59.25
SA11  (via drill 0.35)
  Top 0.152: v98.14,22.25 92.39,22.25 89.14,19 IC7.14
  Bottom 0.152: v98.14,22.25 99.14,23.25 99.14,56.75 92.89,63 58.64,63 58.64,59.25 59.39,58.5 62.14,58.5 62.14,60.25 U2.23
SA12  (via drill 0.35)
  Top 0.152: v52.64,48.5 67.64,48.5 68.14,49 v87.39,49
  Bottom 0.152: v52.64,48.5 52.64,45.5 52.39,45.25 U2.2 | v87.39,49 88.89,47.5 88.89,21.5 91.39,19 IC7.13
SA13  (via drill 0.35)
  Top 0.152: v94.64,52 93.39,53.25 v60.39,53.25
  Bottom 0.152: v94.64,52 96.39,50.25 96.39,42.75 94.39,40.75 94.39,19.25 94.14,19 IC7.12 | v60.39,53.25 54.89,58.75 54.89,60.25 U2.26
VCC  (via drill 0.35)
  Top 0.152: 31.64,20.75 31.64,17.75 32.39,17 36.64,17 37.14,16.5 C6.2 37.39,16.25 37.89,15.75 59.39,15.75 | 31.64,20.75 39.89,20.75 41.64,19 IC6.20 | 59.39,15.75 60.14,16.5 69.14,16.5 C7.2 | 59.39,15.75 v58.89,15.25 | v68.89,19 73.64,19 IC7.20 | 31.64,20.75 11.64,20.75 9.89,19 IC5.20 | v51.39,48.5 52.14,47.75 86.14,47.75 86.39,47.5 U$2.P$2 | C1.2 45.89,33.25 45.39,33.75 40.64,33.75 38.89,32 IC4.9 38.64,32 36.39,32 IC4.10 36.14,32 34.39,33.75 33.14,33.75 31.39,32 IC4.12 31.14,32 28.89,32 IC4.13 28.64,32 26.39,32 IC4.14 26.14,31.75 24.64,31.75 22.39,29.5 C4.2 | C8.2 20.14,57.75 22.39,60 23.64,60 IC8.16 | R1.2 6.64,52 15.14,43.5 22.14,43.5 C3.2 22.39,43.5 23.89,43.5 26.14,45.75 IC3.14
  Bottom 0.152: 9.64,16.5 5.39,16.5 C5.2 | 9.64,16.5 9.64,18.75 IC5.20 | 9.64,16.5 9.64,11.5 IC5.1 | v58.89,15.25 55.89,12.25 55.89,2.75 U$1.18 | U1.33 67.64,39.25 68.89,38 v68.89,19 68.89,16.75 69.14,16.5 C7.2 | U2.28 49.64,60.25 49.64,57.25 46.39,54 C2.2 46.39,53.75 46.39,53.5 46.64,53.25 | 46.64,53.25 v51.39,48.5 | C8.2 20.14,57.5 22.14,55.5 22.14,43.5 C3.2 22.39,43.25 23.39,42.25 23.39,34.75 26.14,32 IC4.14 | 46.64,53.25 45.14,51.75 45.14,34 45.89,33.25 C1.2 | C6.2 37.14,16.25 35.14,14.25 33.89,14.25 33.89,22.25 35.14,23.5 35.14,27 36.14,28 36.14,31.75 IC4.10
~CAS  (via drill 0.35)
  Top 0.152: IC3.13 28.89,45.75 28.89,44.75 30.39,43.25 49.64,43.25 v50.89,42 51.14,41.75 v68.64,41.75
  Bottom 0.152: v50.89,42 50.89,38.75 51.39,38.25 51.39,25.25 52.14,24.5 U1.2 | v68.64,41.75 68.64,59 69.89,60.25 U2.20
~CE
  Top 0.152: IC4.1 26.39,24.25 28.14,22.5 31.89,22.5 33.64,24.25 IC4.4
  Bottom 0.152: IC8.12 33.89,60 27.64,53.75 27.64,29.5 26.39,28.25 26.39,24.5 IC4.1
~CSR
  Top 0.152: U1.15 85.14,24.5 83.64,26 40.61,26 IC4.6
~CSW
  Top 0.152: U1.14 82.64,24.25 80.89,22.5 35.79,22.5 35.05,23.24 35.05,25.66 34.67,26.04 33.02,26.04 IC4.3
~INT  (via drill 0.35)
  Top 0.152: v41.14,28.25 41.39,28 68.64,28 69.14,28.5 90.89,28.5 90.89,26.75 90.64,26.5 89.89,26.5 87.89,24.5 U1.16 | v35.39,16.25 34.89,15.75 10.64,15.75 3.14,8.25 D1.C
  Bottom 0.152: v41.14,28.25 39.89,27 39.89,20.75 v35.39,16.25
~IRQ  (via drill 0.35)
  Top 0.152: v43.39,5.5 42.89,6 15.14,6 13.14,8 D1.A
  Bottom 0.152: v43.39,5.5 43.39,4.75 45.39,2.75 U$1.22
~R/W
  Bottom 0.152: IC4.5 36.39,24.5 37.14,25.25 37.14,30.5 37.64,31 37.64,37.25 38.64,38.25 IC3.6
~RAS  (via drill 0.35)
  Top 0.152: v48.89,36.5 33.14,36.5 31.39,38.25 IC3.3
  Bottom 0.152: v48.89,36.5 49.64,35.75 49.64,24.5 U1.1
~RW  (via drill 0.35)
  Top 0.152: v43.64,59.25 44.39,60 47.39,60 48.64,61.25 48.64,62 63.39,62 64.89,60.5 U2.22
  Bottom 0.152: v43.64,59.25 37.89,53.5 37.89,51.5 35.14,48.75 35.14,44.75 28.89,38.5 IC3.2
~WR  (via drill 0.35)
  Top 0.152: v12.89,29 20.39,36.5 24.39,36.5 | 24.39,36.5 26.14,38.25 IC3.1 | v74.89,34.25 74.14,35 v53.39,35 49.14,35 48.89,35.25 25.64,35.25 24.39,36.5
  Bottom 0.152: v12.89,29 12.89,19.5 12.39,19 IC5.19 | v74.89,34.25 74.89,24.75 75.14,24.5 U1.11 | v53.39,35 53.39,59.25 52.39,60.25 U2.27

### Text on the board
tNames: D7 | D6 | D5 | D4 | D3 | D2 | D1 | D0 | A0 | A1 | A2 | A3 | A4 | A5 | A6 | A7 | A8 | A9 | A10 | A11 | A12 | A13 | A14 | A15
bNames: BO6502 - VDU TMS rev. 01